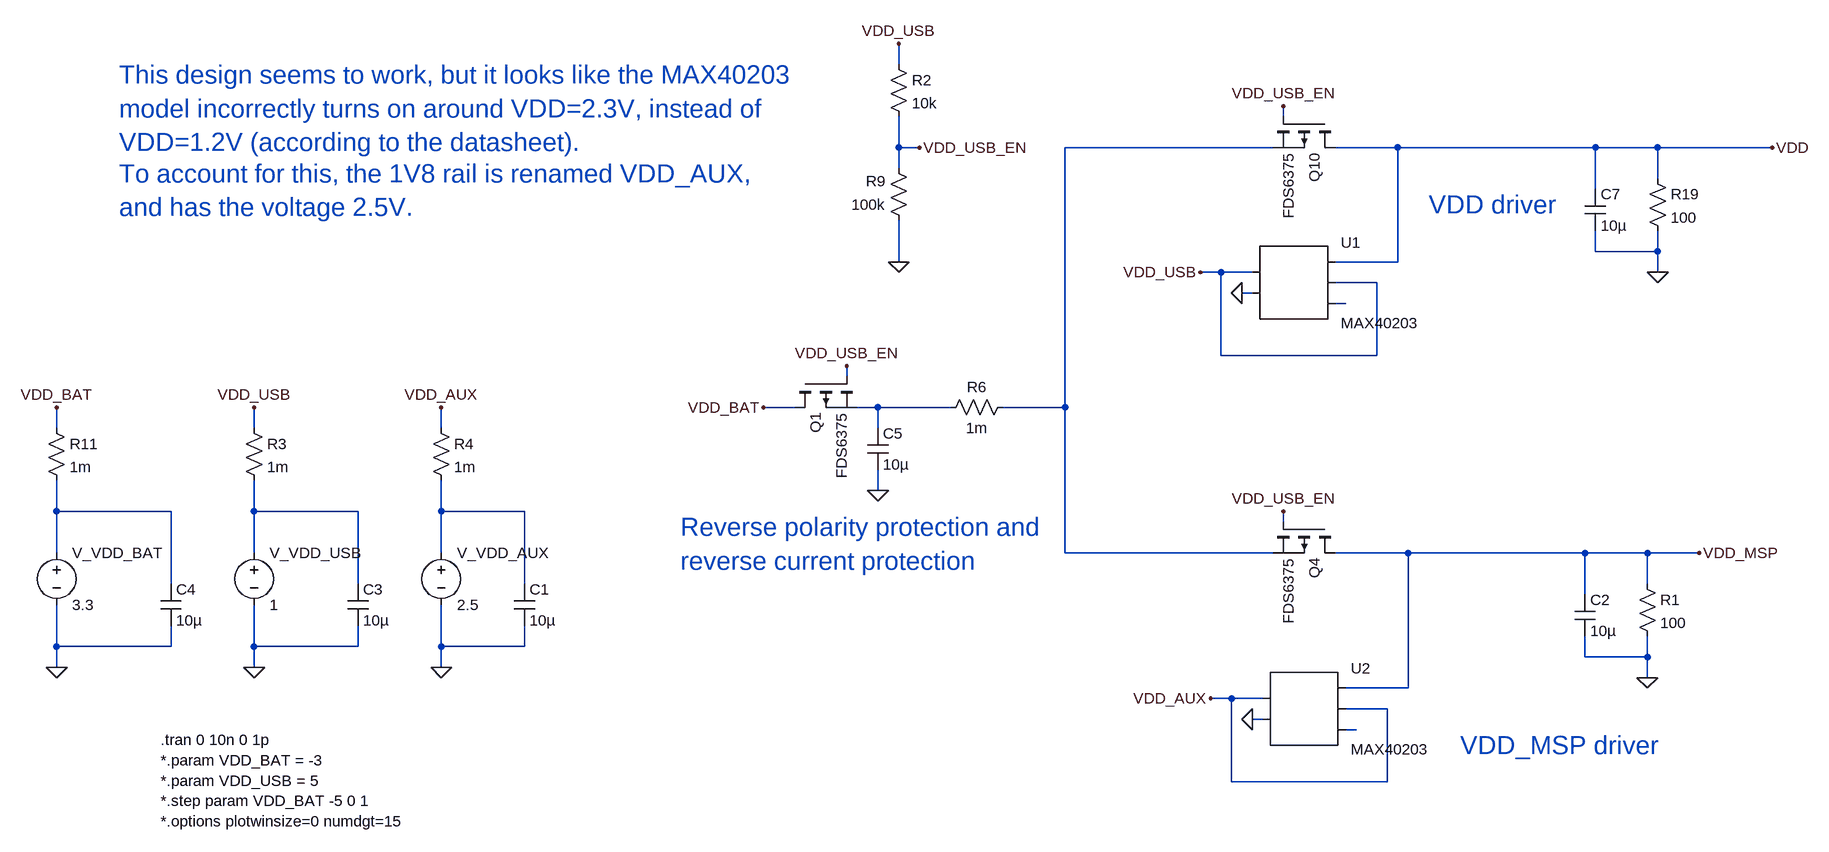
[diagram p0: schematic Schematic.asc]
Schematic.asc, the LTspice schematic file:
Version 4
SHEET 1 1688 864
WIRE -864 -1120 -864 -1152
WIRE -272 -1040 -272 -1056
WIRE -864 -992 -864 -1040
WIRE -832 -992 -864 -992
WIRE -288 -992 -608 -992
WIRE -96 -992 -192 -992
WIRE 208 -992 -96 -992
WIRE 304 -992 208 -992
WIRE 480 -992 304 -992
WIRE -864 -960 -864 -992
WIRE 304 -944 304 -992
WIRE 208 -928 208 -992
WIRE 208 -832 208 -864
WIRE 304 -832 304 -864
WIRE 304 -832 208 -832
WIRE -864 -816 -864 -880
WIRE -96 -816 -96 -992
WIRE -96 -816 -192 -816
WIRE -368 -800 -400 -800
WIRE -320 -800 -368 -800
WIRE 304 -800 304 -832
WIRE -128 -784 -192 -784
WIRE -320 -768 -336 -768
WIRE -176 -752 -192 -752
WIRE -368 -672 -368 -800
WIRE -128 -672 -128 -784
WIRE -128 -672 -368 -672
WIRE -944 -640 -944 -656
WIRE -1024 -592 -1072 -592
WIRE -896 -592 -928 -592
WIRE -784 -592 -896 -592
WIRE -608 -592 -608 -992
WIRE -608 -592 -704 -592
WIRE -2160 -560 -2160 -592
WIRE -1856 -560 -1856 -592
WIRE -1568 -560 -1568 -592
WIRE -896 -560 -896 -592
WIRE -896 -464 -896 -496
WIRE -2160 -432 -2160 -480
WIRE -1984 -432 -2160 -432
WIRE -1856 -432 -1856 -480
WIRE -1696 -432 -1856 -432
WIRE -1568 -432 -1568 -480
WIRE -1440 -432 -1568 -432
WIRE -272 -416 -272 -432
WIRE -2160 -368 -2160 -432
WIRE -1856 -368 -1856 -432
WIRE -1568 -368 -1568 -432
WIRE -608 -368 -608 -592
WIRE -288 -368 -608 -368
WIRE -80 -368 -192 -368
WIRE 192 -368 -80 -368
WIRE 288 -368 192 -368
WIRE 368 -368 288 -368
WIRE -1984 -320 -1984 -432
WIRE -1696 -320 -1696 -432
WIRE -1440 -320 -1440 -432
WIRE 288 -320 288 -368
WIRE 192 -304 192 -368
WIRE -2160 -224 -2160 -288
WIRE -1984 -224 -1984 -256
WIRE -1984 -224 -2160 -224
WIRE -1856 -224 -1856 -288
WIRE -1696 -224 -1696 -256
WIRE -1696 -224 -1856 -224
WIRE -1568 -224 -1568 -288
WIRE -1440 -224 -1440 -256
WIRE -1440 -224 -1568 -224
WIRE 192 -208 192 -240
WIRE 288 -208 288 -240
WIRE 288 -208 192 -208
WIRE -2160 -192 -2160 -224
WIRE -1856 -192 -1856 -224
WIRE -1568 -192 -1568 -224
WIRE 288 -176 288 -208
WIRE -80 -160 -80 -368
WIRE -80 -160 -176 -160
WIRE -352 -144 -384 -144
WIRE -304 -144 -352 -144
WIRE -112 -128 -176 -128
WIRE -304 -112 -320 -112
WIRE -160 -96 -176 -96
WIRE -352 -16 -352 -144
WIRE -112 -16 -112 -128
WIRE -112 -16 -352 -16
FLAG 368 -368 VDD_MSP
FLAG -1856 -192 0
FLAG -2160 -192 0
FLAG -1568 -192 0
FLAG 288 -176 0
FLAG -864 -1152 VDD_USB
FLAG -1856 -592 VDD_USB
FLAG -1568 -592 VDD_AUX
FLAG -1072 -592 VDD_BAT
FLAG -2160 -592 VDD_BAT
FLAG -896 -464 0
FLAG -864 -816 0
FLAG 480 -992 VDD
FLAG 304 -800 0
FLAG -832 -992 VDD_USB_EN
FLAG -272 -1056 VDD_USB_EN
FLAG -944 -656 VDD_USB_EN
FLAG -272 -432 VDD_USB_EN
FLAG -400 -800 VDD_USB
FLAG -336 -768 0
FLAG -384 -144 VDD_AUX
FLAG -320 -112 0
SYMBOL res 272 -336 R0
SYMATTR InstName R1
SYMATTR Value 100
SYMBOL res -880 -1136 R0
SYMATTR InstName R2
SYMATTR Value 10k
SYMBOL res -1872 -576 R0
SYMATTR InstName R3
SYMATTR Value 1m
SYMBOL cap 176 -304 R0
SYMATTR InstName C2
SYMATTR Value 10µ
SYMBOL cap -1456 -320 R0
SYMATTR InstName C1
SYMATTR Value 10µ
SYMBOL cap -1712 -320 R0
SYMATTR InstName C3
SYMATTR Value 10µ
SYMBOL cap -2000 -320 R0
SYMATTR InstName C4
SYMATTR Value 10µ
SYMBOL res -2176 -576 R0
SYMATTR InstName R11
SYMATTR Value 1m
SYMBOL voltage -2160 -384 R0
SYMATTR InstName V_VDD_BAT
SYMATTR Value 3.3
SYMATTR SpiceLine Cpar=1f
SYMBOL voltage -1856 -384 R0
SYMATTR InstName V_VDD_USB
SYMATTR Value 1
SYMBOL voltage -1568 -384 R0
SYMATTR InstName V_VDD_AUX
SYMATTR Value 2.5
SYMBOL res -1584 -576 R0
SYMATTR InstName R4
SYMATTR Value 1m
SYMBOL pmos -1024 -640 M90
SYMATTR InstName Q1
SYMATTR Value FDS6375
SYMBOL cap -912 -560 R0
SYMATTR InstName C5
SYMATTR Value 10µ
SYMBOL res -848 -864 R180
WINDOW 0 36 76 Left 2
WINDOW 3 36 40 Left 2
SYMATTR InstName R9
SYMATTR Value 100k
SYMBOL res 288 -960 R0
SYMATTR InstName R19
SYMATTR Value 100
SYMBOL cap 192 -928 R0
SYMATTR InstName C7
SYMATTR Value 10µ
SYMBOL pmos -192 -1040 R90
SYMATTR InstName Q10
SYMATTR Value FDS6375
SYMBOL res -688 -608 R90
WINDOW 0 0 56 VBottom 2
WINDOW 3 32 56 VTop 2
SYMATTR InstName R6
SYMATTR Value 1m
SYMBOL pmos -192 -416 R90
SYMATTR InstName Q4
SYMATTR Value FDS6375
SYMBOL AutoGenerated/MAX40203 -256 -784 R0
SYMATTR InstName U1
SYMBOL AutoGenerated/MAX40203 -240 -128 R0
SYMATTR InstName U2
TEXT -2000 -80 Left 2 !.tran 0 10n 0 1p\n*.param VDD_BAT = -3\n*.param VDD_USB = 5\n*.step param VDD_BAT -5 0 1\n*.options plotwinsize=0 numdgt=15
TEXT -1200 -408 Left 4 ;Reverse polarity protection and\nreverse current protection
TEXT -48 -904 Left 4 ;VDD driver
TEXT 0 -72 Left 4 ;VDD_MSP driver
TEXT -2064 -1104 Left 4 ;This design seems to work, but it looks like the MAX40203\nmodel incorrectly turns on around VDD=2.3V, instead of\nVDD=1.2V (according to the datasheet).
TEXT -2064 -952 Left 4 ;To account for this, the 1V8 rail is renamed VDD_AUX,\nand has the voltage 2.5V.

The netlist it stands for:
* Schematic.asc
R1 VDD_MSP 0 100
R2 VDD_USB VDD_USB_EN 10k
R3 VDD_USB N005 1m
C2 VDD_MSP 0 10µ
C1 N006 0 10µ
C3 N005 0 10µ
C4 N004 0 10µ
R11 VDD_BAT N004 1m
V_VDD_BAT N004 0 3.3 Cpar=1f
V_VDD_USB N005 0 1
V_VDD_AUX N006 0 2.5
R4 VDD_AUX N006 1m
M§Q1 VDD_BAT VDD_USB_EN N003 N003 FDS6375
C5 N003 0 10µ
R9 0 VDD_USB_EN 100k
R19 VDD 0 100
C7 VDD 0 10µ
M§Q10 VDD VDD_USB_EN N001 N001 FDS6375
R6 N001 N003 1m
M§Q4 VDD_MSP VDD_USB_EN N001 N001 FDS6375
* U1: MAX40203 (symbol AutoGenerated/MAX40203 not available, pins judged from their places): pin1=VDD_USB pin2=0 pin3=VDD pin4=VDD_USB pin5=N002
* U2: MAX40203 (symbol AutoGenerated/MAX40203 not available, pins judged from their places): pin1=VDD_AUX pin2=0 pin3=VDD_MSP pin4=VDD_AUX pin5=N007
.model NMOS NMOS
.model PMOS PMOS
.lib standard.mos
.tran 0 10n 0 1p
*.param VDD_BAT = -3
*.param VDD_USB = 5
*.step param VDD_BAT -5 0 1
*.options plotwinsize=0 numdgt=15
* Reverse polarity protection and
* reverse current protection
* VDD driver
* VDD_MSP driver
* This design seems to work, but it looks like the MAX40203
* model incorrectly turns on around VDD=2.3V, instead of
* VDD=1.2V (according to the datasheet).
* To account for this, the 1V8 rail is renamed VDD_AUX,
* and has the voltage 2.5V.
.backanno
.end